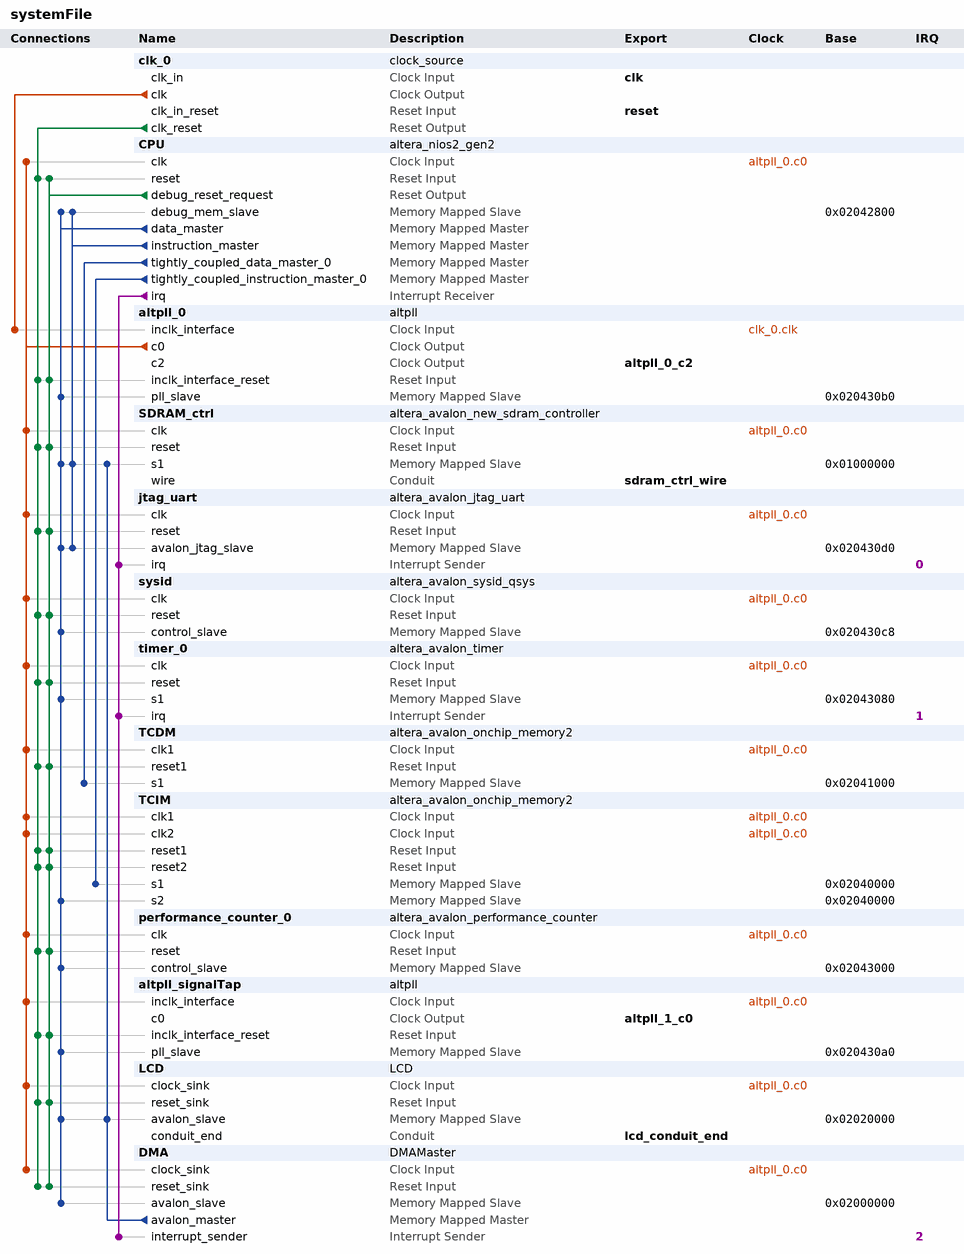
[diagram p0: system contents]
# Platform Designer (Qsys) system systemFile, Cyclone IV E EP4CE30F23C7
# Parameters at their usual value, and those the tool derives, are not listed.
package require -exact qsys 17.0
create_system systemFile
set_project_property DEVICE_FAMILY {Cyclone IV E}
set_project_property DEVICE EP4CE30F23C7

add_instance clk_0 clock_source 17.0
set_instance_parameter_value clk_0 clockFrequency 50000000

add_instance CPU altera_nios2_gen2 17.0
set_instance_parameter_value CPU dcache_bursts true
set_instance_parameter_value CPU dcache_numTCDM 1
set_instance_parameter_value CPU dcache_size 2048
set_instance_parameter_value CPU exceptionSlave TCIM.s1
set_instance_parameter_value CPU icache_burstType Sequential
set_instance_parameter_value CPU icache_numTCIM 1
set_instance_parameter_value CPU icache_size 4096
set_instance_parameter_value CPU impl Fast
set_instance_parameter_value CPU resetSlave SDRAM_ctrl.s1

add_instance altpll_0 altpll 17.0
set_instance_parameter_value altpll_0 CLK0_DIVIDE_BY 1
set_instance_parameter_value altpll_0 CLK0_MULTIPLY_BY 1
set_instance_parameter_value altpll_0 CLK2_DIVIDE_BY 1
set_instance_parameter_value altpll_0 CLK2_DUTY_CYCLE 50
set_instance_parameter_value altpll_0 CLK2_MULTIPLY_BY 1
set_instance_parameter_value altpll_0 CLK2_PHASE_SHIFT 0
set_instance_parameter_value altpll_0 INCLK0_INPUT_FREQUENCY 20000
set_instance_parameter_value altpll_0 PORT_ARESET PORT_UNUSED
set_instance_parameter_value altpll_0 PORT_LOCKED PORT_UNUSED
set_instance_parameter_value altpll_0 PORT_clk1 PORT_UNUSED
set_instance_parameter_value altpll_0 PORT_clk2 PORT_USED
set_instance_parameter_value altpll_0 PORT_clk3 PORT_UNUSED

add_instance SDRAM_ctrl altera_avalon_new_sdram_controller 17.0
set_instance_parameter_value SDRAM_ctrl TAC 5.5
set_instance_parameter_value SDRAM_ctrl TRCD 20.0
set_instance_parameter_value SDRAM_ctrl TRP 20.0
set_instance_parameter_value SDRAM_ctrl casLatency 3
set_instance_parameter_value SDRAM_ctrl columnWidth 9
set_instance_parameter_value SDRAM_ctrl dataWidth 16
set_instance_parameter_value SDRAM_ctrl generateSimulationModel false
set_instance_parameter_value SDRAM_ctrl model single_Micron_MT48LC4M32B2_7_chip
set_instance_parameter_value SDRAM_ctrl numberOfBanks 4
set_instance_parameter_value SDRAM_ctrl numberOfChipSelects 1
set_instance_parameter_value SDRAM_ctrl powerUpDelay 100.0
set_instance_parameter_value SDRAM_ctrl refreshPeriod 15.625
set_instance_parameter_value SDRAM_ctrl rowWidth 12

add_instance jtag_uart altera_avalon_jtag_uart 17.0
set_instance_parameter_value jtag_uart simInteractiveOptions NO_INTERACTIVE_WINDOWS

add_instance sysid altera_avalon_sysid_qsys 17.0
set_instance_parameter_value sysid id 0

add_instance timer_0 altera_avalon_timer 17.0
set_instance_parameter_value timer_0 fixedPeriod true
set_instance_parameter_value timer_0 period 10
set_instance_parameter_value timer_0 periodUnits MSEC

add_instance TCDM altera_avalon_onchip_memory2 17.0
set_instance_parameter_value TCDM dataWidth 32
set_instance_parameter_value TCDM dualPort false
set_instance_parameter_value TCDM enableDiffWidth true
set_instance_parameter_value TCDM initMemContent true
set_instance_parameter_value TCDM initializationFileName onchip_mem.hex
set_instance_parameter_value TCDM memorySize 4096

add_instance TCIM altera_avalon_onchip_memory2 17.0
set_instance_parameter_value TCIM dataWidth 32
set_instance_parameter_value TCIM dualPort true
set_instance_parameter_value TCIM initMemContent true
set_instance_parameter_value TCIM initializationFileName onchip_mem.hex
set_instance_parameter_value TCIM memorySize 4096

add_instance performance_counter_0 altera_avalon_performance_counter 17.0
set_instance_parameter_value performance_counter_0 numberOfSections 7

add_instance altpll_signalTap altpll 17.0
set_instance_parameter_value altpll_signalTap CLK0_DIVIDE_BY 1
set_instance_parameter_value altpll_signalTap CLK0_MULTIPLY_BY 4
set_instance_parameter_value altpll_signalTap INCLK0_INPUT_FREQUENCY 10000
set_instance_parameter_value altpll_signalTap PORT_ARESET PORT_UNUSED
set_instance_parameter_value altpll_signalTap PORT_LOCKED PORT_UNUSED
set_instance_parameter_value altpll_signalTap PORT_clk1 PORT_UNUSED
set_instance_parameter_value altpll_signalTap PORT_clk2 PORT_UNUSED
set_instance_parameter_value altpll_signalTap PORT_clk3 PORT_UNUSED

add_instance LCD LCD 1.0
set_instance_parameter_value LCD PICSIZE_BIN 17
set_instance_parameter_value LCD PICSIZE_DEC 76800

add_instance DMA DMAMaster 1.0
set_instance_parameter_value DMA PICSIZE_BIN 17
set_instance_parameter_value DMA PICSIZE_DEC 76800

# connections
add_connection altpll_0.c0 altpll_signalTap.inclk_interface clock
add_connection altpll_0.c0 CPU.clk clock
add_connection altpll_0.c0 DMA.clock_sink clock
add_connection altpll_0.c0 jtag_uart.clk clock
add_connection altpll_0.c0 LCD.clock_sink clock
add_connection altpll_0.c0 performance_counter_0.clk clock
add_connection altpll_0.c0 SDRAM_ctrl.clk clock
add_connection altpll_0.c0 sysid.clk clock
add_connection altpll_0.c0 TCDM.clk1 clock
add_connection altpll_0.c0 TCIM.clk1 clock
add_connection altpll_0.c0 TCIM.clk2 clock
add_connection altpll_0.c0 timer_0.clk clock
add_connection clk_0.clk altpll_0.inclk_interface clock
add_connection clk_0.clk_reset altpll_0.inclk_interface_reset reset
add_connection clk_0.clk_reset altpll_signalTap.inclk_interface_reset reset
add_connection clk_0.clk_reset CPU.reset reset
add_connection clk_0.clk_reset DMA.reset_sink reset
add_connection clk_0.clk_reset jtag_uart.reset reset
add_connection clk_0.clk_reset LCD.reset_sink reset
add_connection clk_0.clk_reset performance_counter_0.reset reset
add_connection clk_0.clk_reset SDRAM_ctrl.reset reset
add_connection clk_0.clk_reset sysid.reset reset
add_connection clk_0.clk_reset TCDM.reset1 reset
add_connection clk_0.clk_reset TCIM.reset1 reset
add_connection clk_0.clk_reset TCIM.reset2 reset
add_connection clk_0.clk_reset timer_0.reset reset
add_connection CPU.debug_reset_request altpll_0.inclk_interface_reset reset
add_connection CPU.debug_reset_request altpll_signalTap.inclk_interface_reset reset
add_connection CPU.debug_reset_request CPU.reset reset
add_connection CPU.debug_reset_request DMA.reset_sink reset
add_connection CPU.debug_reset_request jtag_uart.reset reset
add_connection CPU.debug_reset_request LCD.reset_sink reset
add_connection CPU.debug_reset_request performance_counter_0.reset reset
add_connection CPU.debug_reset_request SDRAM_ctrl.reset reset
add_connection CPU.debug_reset_request sysid.reset reset
add_connection CPU.debug_reset_request TCDM.reset1 reset
add_connection CPU.debug_reset_request TCIM.reset1 reset
add_connection CPU.debug_reset_request TCIM.reset2 reset
add_connection CPU.debug_reset_request timer_0.reset reset
add_connection CPU.data_master altpll_0.pll_slave avalon
set_connection_parameter_value CPU.data_master/altpll_0.pll_slave baseAddress 0x020430b0
add_connection CPU.data_master altpll_signalTap.pll_slave avalon
set_connection_parameter_value CPU.data_master/altpll_signalTap.pll_slave baseAddress 0x020430a0
add_connection CPU.data_master CPU.debug_mem_slave avalon
set_connection_parameter_value CPU.data_master/CPU.debug_mem_slave baseAddress 0x02042800
add_connection CPU.data_master DMA.avalon_slave avalon
set_connection_parameter_value CPU.data_master/DMA.avalon_slave baseAddress 0x02000000
add_connection CPU.data_master jtag_uart.avalon_jtag_slave avalon
set_connection_parameter_value CPU.data_master/jtag_uart.avalon_jtag_slave baseAddress 0x020430d0
add_connection CPU.data_master LCD.avalon_slave avalon
set_connection_parameter_value CPU.data_master/LCD.avalon_slave baseAddress 0x02020000
add_connection CPU.data_master performance_counter_0.control_slave avalon
set_connection_parameter_value CPU.data_master/performance_counter_0.control_slave baseAddress 0x02043000
add_connection CPU.data_master SDRAM_ctrl.s1 avalon
set_connection_parameter_value CPU.data_master/SDRAM_ctrl.s1 baseAddress 0x01000000
add_connection CPU.data_master sysid.control_slave avalon
set_connection_parameter_value CPU.data_master/sysid.control_slave baseAddress 0x020430c8
add_connection CPU.data_master TCIM.s2 avalon
set_connection_parameter_value CPU.data_master/TCIM.s2 baseAddress 0x02040000
add_connection CPU.data_master timer_0.s1 avalon
set_connection_parameter_value CPU.data_master/timer_0.s1 baseAddress 0x02043080
add_connection CPU.instruction_master CPU.debug_mem_slave avalon
set_connection_parameter_value CPU.instruction_master/CPU.debug_mem_slave baseAddress 0x02042800
add_connection CPU.instruction_master jtag_uart.avalon_jtag_slave avalon
set_connection_parameter_value CPU.instruction_master/jtag_uart.avalon_jtag_slave baseAddress 0x020430d0
add_connection CPU.instruction_master SDRAM_ctrl.s1 avalon
set_connection_parameter_value CPU.instruction_master/SDRAM_ctrl.s1 baseAddress 0x01000000
add_connection CPU.tightly_coupled_data_master_0 TCDM.s1 avalon
set_connection_parameter_value CPU.tightly_coupled_data_master_0/TCDM.s1 baseAddress 0x02041000
add_connection CPU.tightly_coupled_instruction_master_0 TCIM.s1 avalon
set_connection_parameter_value CPU.tightly_coupled_instruction_master_0/TCIM.s1 baseAddress 0x02040000
add_connection DMA.avalon_master LCD.avalon_slave avalon
set_connection_parameter_value DMA.avalon_master/LCD.avalon_slave baseAddress 0x02020000
add_connection DMA.avalon_master SDRAM_ctrl.s1 avalon
set_connection_parameter_value DMA.avalon_master/SDRAM_ctrl.s1 baseAddress 0x01000000
add_connection CPU.irq DMA.interrupt_sender interrupt
set_connection_parameter_value CPU.irq/DMA.interrupt_sender irqNumber 2
add_connection CPU.irq jtag_uart.irq interrupt
set_connection_parameter_value CPU.irq/jtag_uart.irq irqNumber 0
add_connection CPU.irq timer_0.irq interrupt
set_connection_parameter_value CPU.irq/timer_0.irq irqNumber 1

# exported interfaces
add_interface altpll_0_c2 clock source
set_interface_property altpll_0_c2 EXPORT_OF altpll_0.c2
add_interface altpll_1_c0 clock source
set_interface_property altpll_1_c0 EXPORT_OF altpll_signalTap.c0
add_interface clk clock sink
set_interface_property clk EXPORT_OF clk_0.clk_in
add_interface lcd_conduit_end conduit end
set_interface_property lcd_conduit_end EXPORT_OF LCD.conduit_end
add_interface reset reset sink
set_interface_property reset EXPORT_OF clk_0.clk_in_reset
add_interface sdram_ctrl_wire conduit end
set_interface_property sdram_ctrl_wire EXPORT_OF SDRAM_ctrl.wire

set_interconnect_requirement {$system} qsys_mm.clockCrossingAdapter HANDSHAKE
set_interconnect_requirement {$system} qsys_mm.enableEccProtection FALSE
set_interconnect_requirement {$system} qsys_mm.insertDefaultSlave FALSE
set_interconnect_requirement {$system} qsys_mm.maxAdditionalLatency 1

save_system systemFile.qsys
